# EAGLE schematic pcb-pick-plaz-control_v1d (EAGLE 9.6.2)

## Sheet 1 of 5
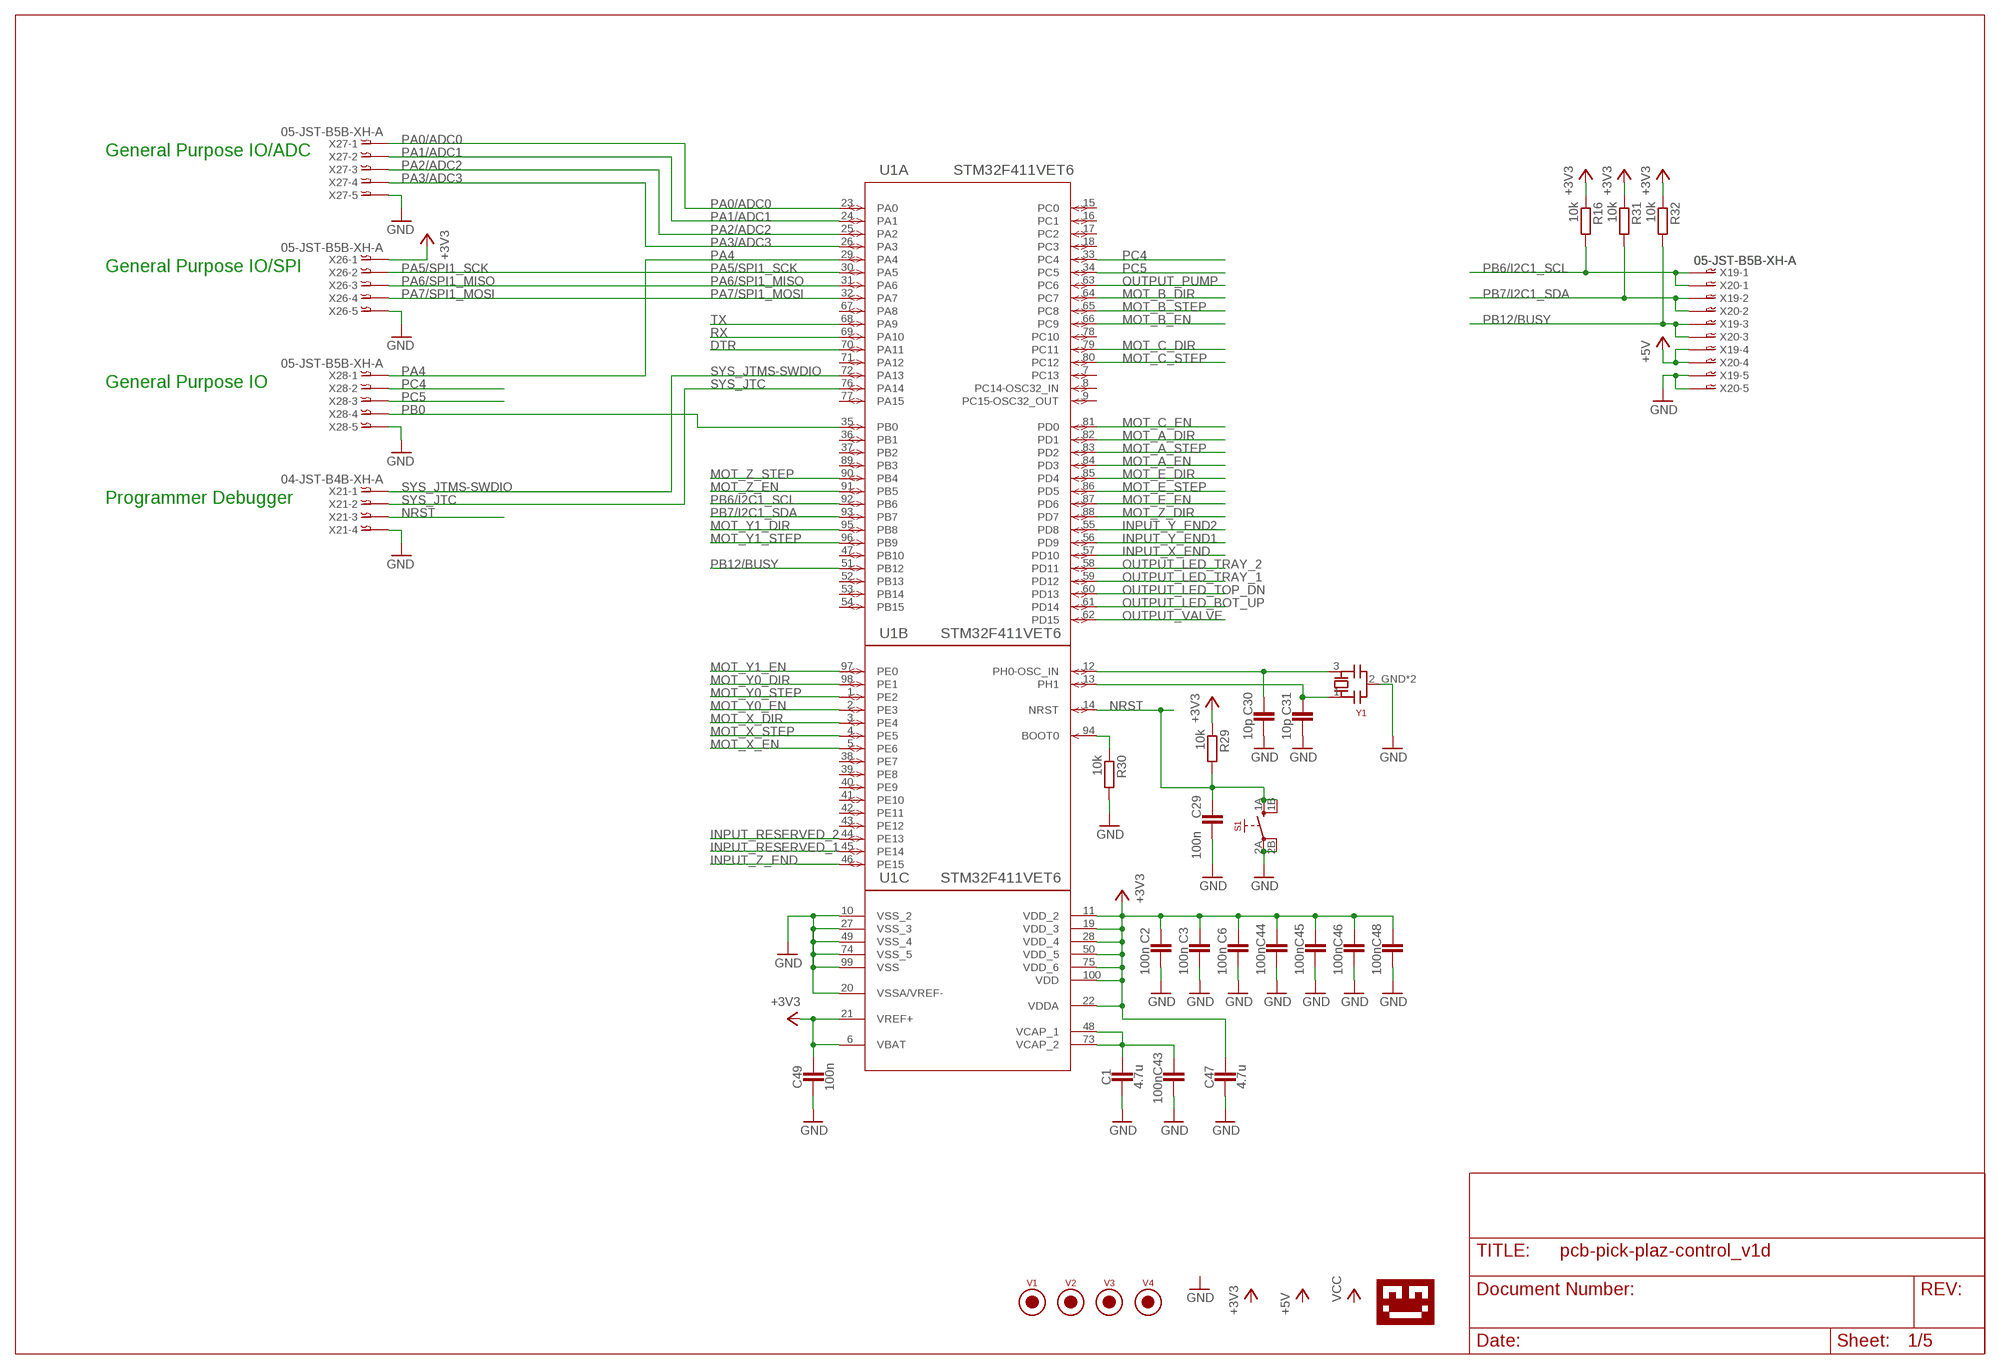
[diagram p0: schematic, sheet 1]

### Parts
C1  4.7u  CAPACITOR0805_CAP  [0805_CAP]
C2  100n  CAPACITOR0603_CAP  [0603_CAP]
C3  100n  CAPACITOR0603_CAP  [0603_CAP]
C6  100n  CAPACITOR0603_CAP  [0603_CAP]
C29  100n  CAPACITOR0603_CAP  [0603_CAP]
C30  10p  CAPACITOR0603_CAP  [0603_CAP]
C31  10p  CAPACITOR0603_CAP  [0603_CAP]
C43  100n  CAPACITOR0603_CAP  [0603_CAP]
C44  100n  CAPACITOR0603_CAP  [0603_CAP]
C45  100n  CAPACITOR0603_CAP  [0603_CAP]
C46  100n  CAPACITOR0603_CAP  [0603_CAP]
C47  4.7u  CAPACITOR0805_CAP  [0805_CAP]
C48  100n  CAPACITOR0603_CAP  [0603_CAP]
C49  100n  CAPACITOR0603_CAP  [0603_CAP]
R16  10k  RESISTOR0603_RES  [0603-RES]
R29  10k  RESISTOR0603_RES  [0603-RES]
R30  10k  RESISTOR0603_RES  [0603-RES]
R31  10k  RESISTOR0603_RES  [0603-RES]
R32  10k  RESISTOR0603_RES  [0603-RES]
S1  SWITCH_2PD  [SWITCH_WH]
U1  STM32F411VET6  [LQFP100-14X14MM]
U$1  LOGO-TOBENG-1MM-FINISH  [TOBENG-1MM-FINISH]
V1  FIDUCIAL2MM  [FIDUCIAL_2MM]
V2  FIDUCIAL2MM  [FIDUCIAL_2MM]
V3  FIDUCIAL2MM  [FIDUCIAL_2MM]
V4  FIDUCIAL2MM  [FIDUCIAL_2MM]
X19  05-JST-B5B-XH-A  [B5B-XH]
X20  05-JST-B5B-XH-A  [B5B-XH]
X21  04-JST-B4B-XH-A  [B4B-XH]
X26  05-JST-B5B-XH-A  [B5B-XH]
X27  05-JST-B5B-XH-A  [B5B-XH]
X28  05-JST-B5B-XH-A  [B5B-XH]
Y1  3213-QUARZ3225  [3225-QUARZ]

### Nets
+3V3: C2.1 C3.1 C6.1 C44.1 C45.1 C46.1 C47.P$1 C48.1 C49.1 R16.1 R29.1 R31.1 R32.1 U1.6(C:VBAT) U1.11(C:VDD_2) U1.19(C:VDD_3) U1.21(C:VREF+) U1.22(C:VDDA) U1.28(C:VDD_4) U1.50(C:VDD_5) U1.75(C:VDD_6) U1.100(C:VDD) X26.P$1 ; also sheet 3,4,5
+5V: X19.P$4 X20.P$4 ; also sheet 2,4,5
DTR: U1.70(A:PA11) ; also sheet 2
GND: C1.P$2 C2.2 C3.2 C6.2 C29.2 C30.2 C31.2 C43.2 C44.2 C45.2 C46.2 C47.P$2 C48.2 C49.2 R30.2 S1.2A S1.2B U1.10(C:VSS_2) U1.20(C:VSSA/VREF-) U1.27(C:VSS_3) U1.49(C:VSS_4) U1.74(C:VSS_5) U1.99(C:VSS) X19.P$5 X20.P$5 X21.P$4 X26.P$5 X27.P$5 X28.P$5 Y1.2_GND Y1.4_GND ; also sheet 2,3,4,5
INPUT_RESERVED_1: U1.45(B:PE14) ; also sheet 4
INPUT_RESERVED_2: U1.44(B:PE13) ; also sheet 4
INPUT_X_END: U1.57(A:PD10) ; also sheet 4
INPUT_Y_END1: U1.56(A:PD9) ; also sheet 4
INPUT_Y_END2: U1.55(A:PD8) ; also sheet 4
INPUT_Z_END: U1.46(B:PE15) ; also sheet 4
MOT_A_DIR: U1.82(A:PD1) ; also sheet 3
MOT_A_EN: U1.84(A:PD3) ; also sheet 3
MOT_A_STEP: U1.83(A:PD2) ; also sheet 3
MOT_B_DIR: U1.64(A:PC7) ; also sheet 3
MOT_B_EN: U1.66(A:PC9) ; also sheet 3
MOT_B_STEP: U1.65(A:PC8) ; also sheet 3
MOT_C_DIR: U1.79(A:PC11) ; also sheet 3
MOT_C_EN: U1.81(A:PD0) ; also sheet 3
MOT_C_STEP: U1.80(A:PC12) ; also sheet 3
MOT_E_DIR: U1.85(A:PD4) ; also sheet 3
MOT_E_EN: U1.87(A:PD6) ; also sheet 3
MOT_E_STEP: U1.86(A:PD5) ; also sheet 3
MOT_X_DIR: U1.3(B:PE4) ; also sheet 3
MOT_X_EN: U1.5(B:PE6) ; also sheet 3
MOT_X_STEP: U1.4(B:PE5) ; also sheet 3
MOT_Y0_DIR: U1.98(B:PE1) ; also sheet 3
MOT_Y0_EN: U1.2(B:PE3) ; also sheet 3
MOT_Y0_STEP: U1.1(B:PE2) ; also sheet 3
MOT_Y1_DIR: U1.95(A:PB8) ; also sheet 3
MOT_Y1_EN: U1.97(B:PE0) ; also sheet 3
MOT_Y1_STEP: U1.96(A:PB9) ; also sheet 3
MOT_Z_DIR: U1.88(A:PD7) ; also sheet 3
MOT_Z_EN: U1.91(A:PB5) ; also sheet 3
MOT_Z_STEP: U1.90(A:PB4) ; also sheet 3
N$1: R30.1 U1.94(B:BOOT0)
N$15: C1.P$1 C43.1 U1.48(C:VCAP_1) U1.73(C:VCAP_2)
N$70: C30.1 U1.12(B:PH0-OSC_IN) Y1.3
N$71: C31.1 U1.13(B:PH1) Y1.1
NRST: C29.1 R29.2 S1.1A S1.1B U1.14(B:NRST) X21.P$3
OUTPUT_LED_BOT_UP: U1.61(A:PD14) ; also sheet 4
OUTPUT_LED_TOP_DN: U1.60(A:PD13) ; also sheet 4
OUTPUT_LED_TRAY_1: U1.59(A:PD12) ; also sheet 4
OUTPUT_LED_TRAY_2: U1.58(A:PD11) ; also sheet 4
OUTPUT_PUMP: U1.63(A:PC6) ; also sheet 4
OUTPUT_VALVE: U1.62(A:PD15) ; also sheet 4
PA0/ADC0: U1.23(A:PA0) X27.P$1
PA1/ADC1: U1.24(A:PA1) X27.P$2
PA2/ADC2: U1.25(A:PA2) X27.P$3
PA3/ADC3: U1.26(A:PA3) X27.P$4
PA4: U1.29(A:PA4) X28.P$1
PA5/SPI1_SCK: U1.30(A:PA5) X26.P$2
PA6/SPI1_MISO: U1.31(A:PA6) X26.P$3
PA7/SPI1_MOSI: U1.32(A:PA7) X26.P$4
PB0: U1.35(A:PB0) X28.P$4
PB6/I2C1_SCL: R16.2 U1.92(A:PB6) X19.P$1 X20.P$1
PB7/I2C1_SDA: R31.2 U1.93(A:PB7) X19.P$2 X20.P$2
PB12/BUSY: R32.2 U1.51(A:PB12) X19.P$3 X20.P$3
PC4: U1.33(A:PC4) X28.P$2
PC5: U1.34(A:PC5) X28.P$3
RX: U1.69(A:PA10) ; also sheet 2
SYS_JTC: U1.76(A:PA14) X21.P$2
SYS_JTMS-SWDIO: U1.72(A:PA13) X21.P$1
TX: U1.68(A:PA9) ; also sheet 2
Unconnected: U1.7(A:PC13) U1.8(A:PC14-OSC32_IN) U1.9(A:PC15-OSC32_OUT) U1.15(A:PC0) U1.16(A:PC1) U1.17(A:PC2) U1.18(A:PC3) U1.36(A:PB1) U1.37(A:PB2) U1.38(B:PE7) U1.39(B:PE8) U1.40(B:PE9) U1.41(B:PE10) U1.42(B:PE11) U1.43(B:PE12) U1.47(A:PB10) U1.52(A:PB13) U1.53(A:PB14) U1.54(A:PB15) U1.67(A:PA8) U1.71(A:PA12) U1.77(A:PA15) U1.78(A:PC10) U1.89(A:PB3)

### Notes on the sheet
- General Purpose IO/ADC
- General Purpose IO/SPI
- General Purpose IO
- Programmer Debugger

## Sheet 2 of 5
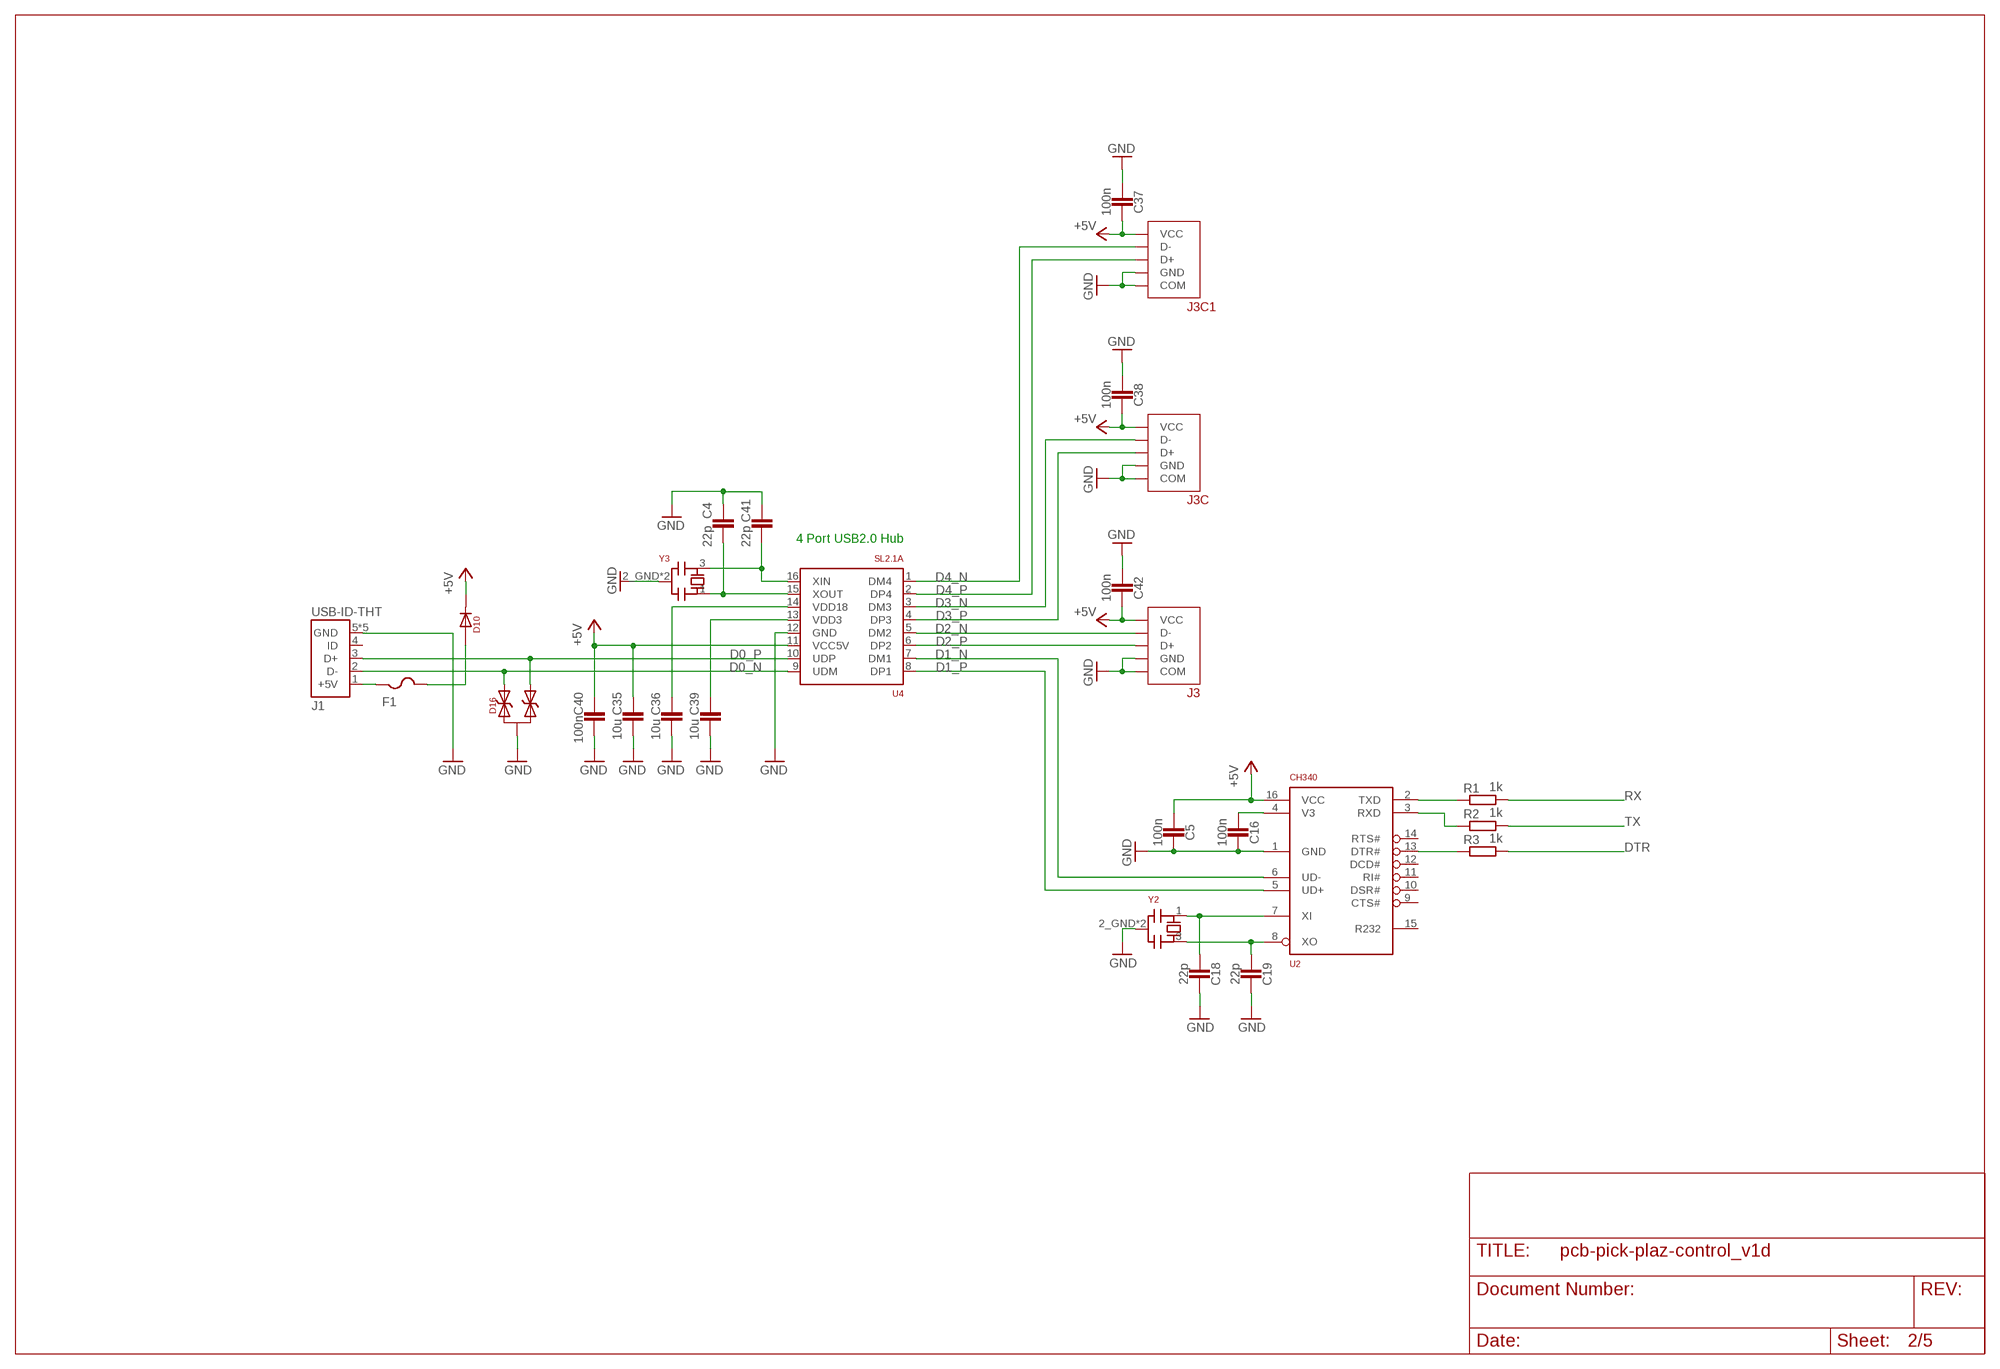
[diagram p1: schematic, sheet 2]

### Parts
C4  22p  CAPACITOR0603_CAP  [0603_CAP]
C5  100n  CAPACITOR0603_CAP  [0603_CAP]
C16  100n  CAPACITOR0603_CAP  [0603_CAP]
C18  22p  CAPACITOR0603_CAP  [0603_CAP]
C19  22p  CAPACITOR0603_CAP  [0603_CAP]
C35  10u  CAPACITOR0805_CAP  [0805_CAP]
C36  10u  CAPACITOR0805_CAP  [0805_CAP]
C37  100n  CAPACITOR0603_CAP  [0603_CAP]
C38  100n  CAPACITOR0603_CAP  [0603_CAP]
C39  10u  CAPACITOR0805_CAP  [0805_CAP]
C40  100n  CAPACITOR0603_CAP  [0603_CAP]
C41  22p  CAPACITOR0603_CAP  [0603_CAP]
C42  100n  CAPACITOR0603_CAP  [0603_CAP]
D10  DIODE-1206  [1206-DOT]
D16  DIODE-TVS  [SOT-23]
F1  PTCFUSE-1206  [R1206]
J1  USB-ID-THT  [USB-MICRO-THT]
J3  USB-LCSC_C42431  [USB-A-LCSC_C42431]
J3C  USB-LCSC_C42431  [USB-A-LCSC_C42431]
J3C1  USB-LCSC_C42431  [USB-A-LCSC_C42431]
R1  1k  RESISTOR0603_RES  [0603-RES]
R2  1k  RESISTOR0603_RES  [0603-RES]
R3  1k  RESISTOR0603_RES  [0603-RES]
U2  CH340  [SOIC-16]
U4  SL2.1A  [SOIC-16]
Y2  3213-QUARZ3225  [3225-QUARZ]
Y3  3213-QUARZ3225  [3225-QUARZ]

### Nets
+5V: C5.2 C35.P$2 C37.1 C38.1 C40.2 C42.1 D10.2 J3.VCC J3C1.VCC J3C.VCC U2.16(VCC) U4.11(VCC5V) ; also sheet 1,4,5
D0_N [usb]: D16.2 J1.2(D-) U4.9(UDM)
D0_P [usb]: D16.1 J1.3(D+) U4.10(UDP)
D1_N [usb]: U2.6(UD-) U4.7(DM1)
D1_P [usb]: U2.5(UD+) U4.8(DP1)
D2_N [usb]: J3.D- U4.5(DM2)
D2_P [usb]: J3.D+ U4.6(DP2)
D3_N [usb]: J3C.D- U4.3(DM3)
D3_P [usb]: J3C.D+ U4.4(DP3)
D4_N [usb]: J3C1.D- U4.1(DM4)
D4_P [usb]: J3C1.D+ U4.2(DP4)
DTR: R3.2 ; also sheet 1
GND: C4.2 C5.1 C16.1 C18.1 C19.1 C35.P$1 C36.P$1 C37.2 C38.2 C39.P$1 C40.1 C41.2 C42.2 D16.3 J1.5(GND) J1.GND1(GND) J1.GND2(GND) J1.GND3(GND) J1.GND4(GND) J3.COM1(COM) J3.COM2(COM) J3.GND J3C1.COM1(COM) J3C1.COM2(COM) J3C1.GND J3C.COM1(COM) J3C.COM2(COM) J3C.GND U2.1(GND) U4.12(GND) Y2.2_GND Y2.4_GND Y3.2_GND Y3.4_GND ; also sheet 1,3,4,5
N$7: C18.2 U2.7(XI) Y2.1
N$8: C19.2 U2.8(XO) Y2.3
N$10: R1.1 U2.2(TXD)
N$11: R2.1 U2.3(RXD)
N$16: C16.2 U2.4(V3)
N$73: C41.1 U4.16(XIN) Y3.3
N$74: R3.1 U2.13(DTR#)
N$76: C4.1 U4.15(XOUT) Y3.1
N$77: C36.P$2 U4.14(VDD18)
N$78: C39.P$2 U4.13(VDD3)
N$81: D10.1 F1.2
RX: R1.2 ; also sheet 1
TX: R2.2 ; also sheet 1
VINUSB: F1.1 J1.1(+5V)
Unconnected: J1.4(ID) U2.9(CTS#) U2.10(DSR#) U2.11(RI#) U2.12(DCD#) U2.14(RTS#) U2.15(R232)

### Notes on the sheet
- 4 Port USB2.0 Hub

## Sheet 3 of 5
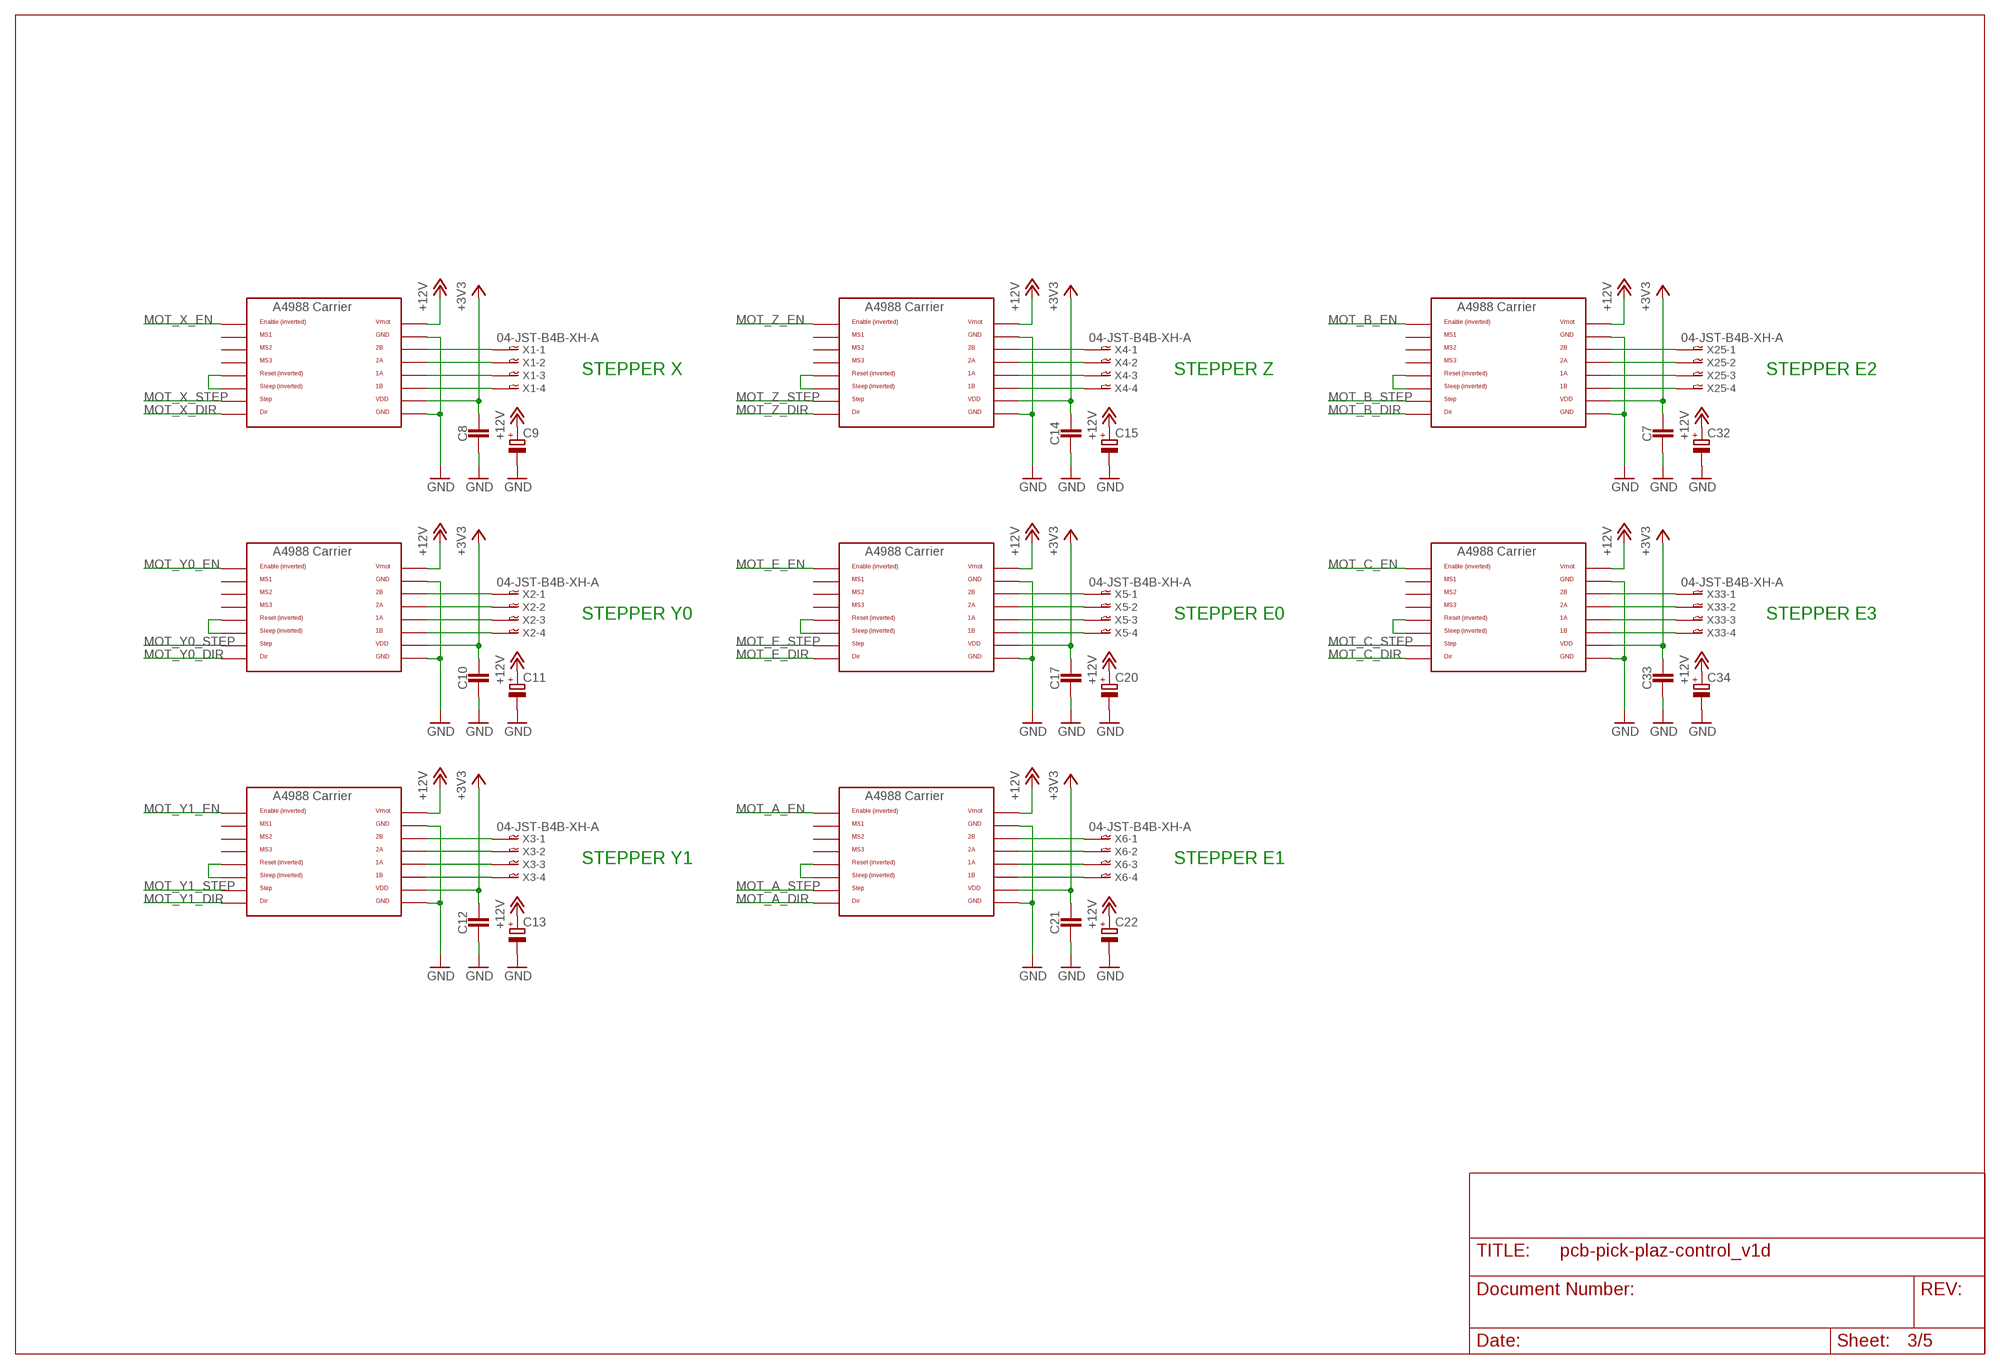
[diagram p2: schematic, sheet 3]

### Parts
C7  CAPACITOR0603_CAP  [0603_CAP]
C8  CAPACITOR0603_CAP  [0603_CAP]
C9  CPOL-EU175TMP-0808  [175TMP-0808]
C10  CAPACITOR0603_CAP  [0603_CAP]
C11  CPOL-EU175TMP-0808  [175TMP-0808]
C12  CAPACITOR0603_CAP  [0603_CAP]
C13  CPOL-EU175TMP-0808  [175TMP-0808]
C14  CAPACITOR0603_CAP  [0603_CAP]
C15  CPOL-EU175TMP-0808  [175TMP-0808]
C17  CAPACITOR0603_CAP  [0603_CAP]
C20  CPOL-EU175TMP-0808  [175TMP-0808]
C21  CAPACITOR0603_CAP  [0603_CAP]
C22  CPOL-EU175TMP-0808  [175TMP-0808]
C32  CPOL-EU175TMP-0808  [175TMP-0808]
C33  CAPACITOR0603_CAP  [0603_CAP]
C34  CPOL-EU175TMP-0808  [175TMP-0808]
U$2  A4988BREAKOUT  [A4988BREAKOUT]
U$3  A4988BREAKOUT  [A4988BREAKOUT]
U$4  A4988BREAKOUT  [A4988BREAKOUT]
U$5  A4988BREAKOUT  [A4988BREAKOUT]
U$6  A4988BREAKOUT  [A4988BREAKOUT]
U$7  A4988BREAKOUT  [A4988BREAKOUT]
U$8  A4988BREAKOUT  [A4988BREAKOUT]
U$9  A4988BREAKOUT  [A4988BREAKOUT]
X1  04-JST-B4B-XH-A  [B4B-XH]
X2  04-JST-B4B-XH-A  [B4B-XH]
X3  04-JST-B4B-XH-A  [B4B-XH]
X4  04-JST-B4B-XH-A  [B4B-XH]
X5  04-JST-B4B-XH-A  [B4B-XH]
X6  04-JST-B4B-XH-A  [B4B-XH]
X25  04-JST-B4B-XH-A  [B4B-XH]
X33  04-JST-B4B-XH-A  [B4B-XH]

### Nets
+3V3: C7.1 C8.1 C10.1 C12.1 C14.1 C17.1 C21.1 C33.1 U$2.VDD U$3.VDD U$4.VDD U$5.VDD U$6.VDD U$7.VDD U$8.VDD U$9.VDD ; also sheet 1,4,5
+12V [power]: C9.+ C11.+ C13.+ C15.+ C20.+ C22.+ C32.+ C34.+ U$2.VMOT U$3.VMOT U$4.VMOT U$5.VMOT U$6.VMOT U$7.VMOT U$8.VMOT U$9.VMOT ; also sheet 4,5
GND: C7.2 C8.2 C9.- C10.2 C11.- C12.2 C13.- C14.2 C15.- C17.2 C20.- C21.2 C22.- C32.- C33.2 C34.- U$2.GND U$2.GND@0(GND) U$3.GND U$3.GND@0(GND) U$4.GND U$4.GND@0(GND) U$5.GND U$5.GND@0(GND) U$6.GND U$6.GND@0(GND) U$7.GND U$7.GND@0(GND) U$8.GND U$8.GND@0(GND) U$9.GND U$9.GND@0(GND) ; also sheet 1,2,4,5
MOT_A_DIR: U$7.DIR ; also sheet 1
MOT_A_EN: U$7.EN ; also sheet 1
MOT_A_STEP: U$7.STEP ; also sheet 1
MOT_B_DIR: U$8.DIR ; also sheet 1
MOT_B_EN: U$8.EN ; also sheet 1
MOT_B_STEP: U$8.STEP ; also sheet 1
MOT_C_DIR: U$9.DIR ; also sheet 1
MOT_C_EN: U$9.EN ; also sheet 1
MOT_C_STEP: U$9.STEP ; also sheet 1
MOT_E_DIR: U$6.DIR ; also sheet 1
MOT_E_EN: U$6.EN ; also sheet 1
MOT_E_STEP: U$6.STEP ; also sheet 1
MOT_X_DIR: U$2.DIR ; also sheet 1
MOT_X_EN: U$2.EN ; also sheet 1
MOT_X_STEP: U$2.STEP ; also sheet 1
MOT_Y0_DIR: U$3.DIR ; also sheet 1
MOT_Y0_EN: U$3.EN ; also sheet 1
MOT_Y0_STEP: U$3.STEP ; also sheet 1
MOT_Y1_DIR: U$4.DIR ; also sheet 1
MOT_Y1_EN: U$4.EN ; also sheet 1
MOT_Y1_STEP: U$4.STEP ; also sheet 1
MOT_Z_DIR: U$5.DIR ; also sheet 1
MOT_Z_EN: U$5.EN ; also sheet 1
MOT_Z_STEP: U$5.STEP ; also sheet 1
N$2 [power]: U$2.2B X1.P$1
N$3 [power]: U$2.2A X1.P$2
N$4 [power]: U$2.1A X1.P$3
N$5 [power]: U$2.1B X1.P$4
N$6 [power]: U$6.2B X5.P$1
N$9: U$2.RST U$2.SLP(SLEEP)
N$13 [power]: U$6.2A X5.P$2
N$14 [power]: U$6.1A X5.P$3
N$17 [power]: U$3.2B X2.P$1
N$18 [power]: U$3.2A X2.P$2
N$19 [power]: U$3.1A X2.P$3
N$20 [power]: U$3.1B X2.P$4
N$21: U$3.RST U$3.SLP(SLEEP)
N$22 [power]: U$4.2B X3.P$1
N$23 [power]: U$4.2A X3.P$2
N$24 [power]: U$4.1A X3.P$3
N$25 [power]: U$4.1B X3.P$4
N$26: U$4.RST U$4.SLP(SLEEP)
N$27 [power]: U$5.2B X4.P$1
N$28 [power]: U$5.2A X4.P$2
N$29 [power]: U$5.1A X4.P$3
N$30 [power]: U$5.1B X4.P$4
N$31: U$5.RST U$5.SLP(SLEEP)
N$32 [power]: U$6.1B X5.P$4
N$33: U$6.RST U$6.SLP(SLEEP)
N$34 [power]: U$7.2B X6.P$1
N$35 [power]: U$7.2A X6.P$2
N$36 [power]: U$7.1A X6.P$3
N$37 [power]: U$7.1B X6.P$4
N$38: U$7.RST U$7.SLP(SLEEP)
N$69 [power]: U$8.2B X25.P$1
N$72 [power]: U$8.2A X25.P$2
N$79 [power]: U$8.1A X25.P$3
N$85 [power]: U$8.1B X25.P$4
N$88: U$8.RST U$8.SLP(SLEEP)
N$93 [power]: U$9.2B X33.P$1
N$95 [power]: U$9.2A X33.P$2
N$96 [power]: U$9.1A X33.P$3
N$97 [power]: U$9.1B X33.P$4
N$98: U$9.RST U$9.SLP(SLEEP)
Unconnected: U$2.MS1 U$2.MS2 U$2.MS3 U$3.MS1 U$3.MS2 U$3.MS3 U$4.MS1 U$4.MS2 U$4.MS3 U$5.MS1 U$5.MS2 U$5.MS3 U$6.MS1 U$6.MS2 U$6.MS3 U$7.MS1 U$7.MS2 U$7.MS3 U$8.MS1 U$8.MS2 U$8.MS3 U$9.MS1 U$9.MS2 U$9.MS3

### Notes on the sheet
- STEPPER X | STEPPER Z | STEPPER E2
- STEPPER Y0 | STEPPER E0 | STEPPER E3
- STEPPER Y1 | STEPPER E1

## Sheet 4 of 5
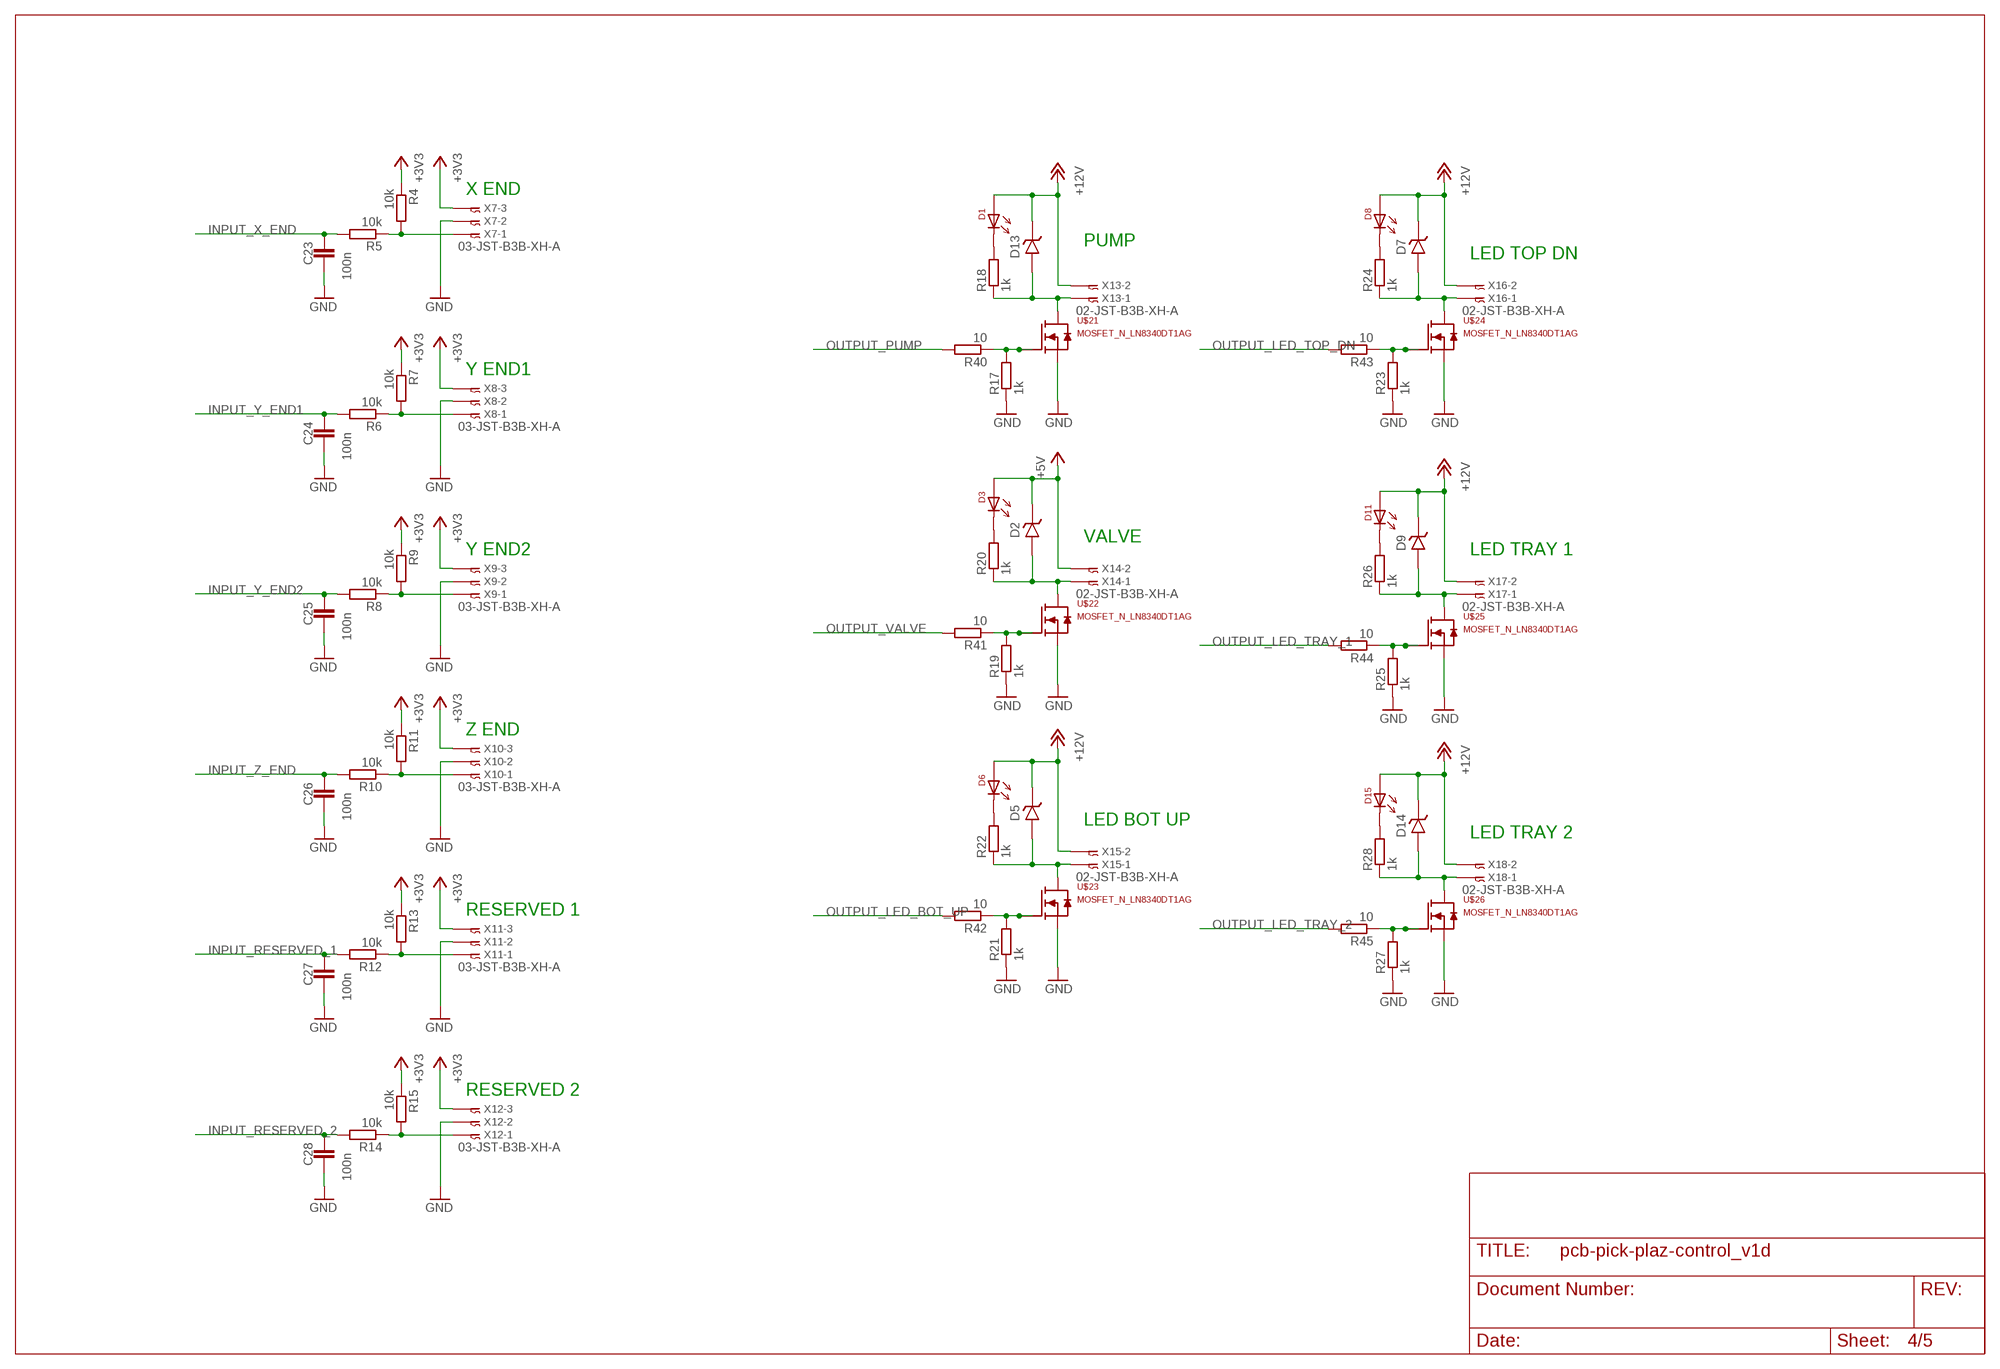
[diagram p3: schematic, sheet 4]

### Parts
C23  100n  CAPACITOR0603_CAP  [0603_CAP]
C24  100n  CAPACITOR0603_CAP  [0603_CAP]
C25  100n  CAPACITOR0603_CAP  [0603_CAP]
C26  100n  CAPACITOR0603_CAP  [0603_CAP]
C27  100n  CAPACITOR0603_CAP  [0603_CAP]
C28  100n  CAPACITOR0603_CAP  [0603_CAP]
D1  LED-0805  [0805-DOT]
D2  DIODE_ZENERSOD123  [SOD123]
D3  LED-0805  [0805-DOT]
D5  DIODE_ZENERSOD123  [SOD123]
D6  LED-0805  [0805-DOT]
D7  DIODE_ZENERSOD123  [SOD123]
D8  LED-0805  [0805-DOT]
D9  DIODE_ZENERSOD123  [SOD123]
D11  LED-0805  [0805-DOT]
D13  DIODE_ZENERSOD123  [SOD123]
D14  DIODE_ZENERSOD123  [SOD123]
D15  LED-0805  [0805-DOT]
R4  10k  RESISTOR0603_RES  [0603-RES]
R5  10k  RESISTOR0603_RES  [0603-RES]
R6  10k  RESISTOR0603_RES  [0603-RES]
R7  10k  RESISTOR0603_RES  [0603-RES]
R8  10k  RESISTOR0603_RES  [0603-RES]
R9  10k  RESISTOR0603_RES  [0603-RES]
R10  10k  RESISTOR0603_RES  [0603-RES]
R11  10k  RESISTOR0603_RES  [0603-RES]
R12  10k  RESISTOR0603_RES  [0603-RES]
R13  10k  RESISTOR0603_RES  [0603-RES]
R14  10k  RESISTOR0603_RES  [0603-RES]
R15  10k  RESISTOR0603_RES  [0603-RES]
R17  1k  RESISTOR0603_RES  [0603-RES]
R18  1k  RESISTOR0603_RES  [0603-RES]
R19  1k  RESISTOR0603_RES  [0603-RES]
R20  1k  RESISTOR0603_RES  [0603-RES]
R21  1k  RESISTOR0603_RES  [0603-RES]
R22  1k  RESISTOR0603_RES  [0603-RES]
R23  1k  RESISTOR0603_RES  [0603-RES]
R24  1k  RESISTOR0603_RES  [0603-RES]
R25  1k  RESISTOR0603_RES  [0603-RES]
R26  1k  RESISTOR0603_RES  [0603-RES]
R27  1k  RESISTOR0603_RES  [0603-RES]
R28  1k  RESISTOR0603_RES  [0603-RES]
R40  10  RESISTOR0603_RES  [0603-RES]
R41  10  RESISTOR0603_RES  [0603-RES]
R42  10  RESISTOR0603_RES  [0603-RES]
R43  10  RESISTOR0603_RES  [0603-RES]
R44  10  RESISTOR0603_RES  [0603-RES]
R45  10  RESISTOR0603_RES  [0603-RES]
U$21  MOSFET_N_LN8340DT1AG  [DFN3030-8B]
U$22  MOSFET_N_LN8340DT1AG  [DFN3030-8B]
U$23  MOSFET_N_LN8340DT1AG  [DFN3030-8B]
U$24  MOSFET_N_LN8340DT1AG  [DFN3030-8B]
U$25  MOSFET_N_LN8340DT1AG  [DFN3030-8B]
U$26  MOSFET_N_LN8340DT1AG  [DFN3030-8B]
X7  03-JST-B3B-XH-A  [B3B-XH]
X8  03-JST-B3B-XH-A  [B3B-XH]
X9  03-JST-B3B-XH-A  [B3B-XH]
X10  03-JST-B3B-XH-A  [B3B-XH]
X11  03-JST-B3B-XH-A  [B3B-XH]
X12  03-JST-B3B-XH-A  [B3B-XH]
X13  02-JST-B3B-XH-A  [B2B-XH]
X14  02-JST-B3B-XH-A  [B2B-XH]
X15  02-JST-B3B-XH-A  [B2B-XH]
X16  02-JST-B3B-XH-A  [B2B-XH]
X17  02-JST-B3B-XH-A  [B2B-XH]
X18  02-JST-B3B-XH-A  [B2B-XH]

### Nets
+3V3: R4.1 R7.1 R9.1 R11.1 R13.1 R15.1 X7.P$3 X8.P$3 X9.P$3 X10.P$3 X11.P$3 X12.P$3 ; also sheet 1,3,5
+5V: D2.K(CATHODE) D3.1 X14.P$2 ; also sheet 1,2,5
+12V [power]: D1.1 D5.K(CATHODE) D6.1 D7.K(CATHODE) D8.1 D9.K(CATHODE) D11.1 D13.K(CATHODE) D14.K(CATHODE) D15.1 X13.P$2 X15.P$2 X16.P$2 X17.P$2 X18.P$2 ; also sheet 3,5
GND: C23.2 C24.2 C25.2 C26.2 C27.2 C28.2 R17.1 R19.1 R21.1 R23.1 R25.1 R27.1 U$21.S1(S) U$21.S2(S) U$21.S3(S) U$22.S1(S) U$22.S2(S) U$22.S3(S) U$23.S1(S) U$23.S2(S) U$23.S3(S) U$24.S1(S) U$24.S2(S) U$24.S3(S) U$25.S1(S) U$25.S2(S) U$25.S3(S) U$26.S1(S) U$26.S2(S) U$26.S3(S) X7.P$2 X8.P$2 X9.P$2 X10.P$2 X11.P$2 X12.P$2 ; also sheet 1,2,3,5
INPUT_RESERVED_1: C27.1 R12.2 ; also sheet 1
INPUT_RESERVED_2: C28.1 R14.2 ; also sheet 1
INPUT_X_END: C23.1 R5.2 ; also sheet 1
INPUT_Y_END1: C24.1 R6.2 ; also sheet 1
INPUT_Y_END2: C25.1 R8.2 ; also sheet 1
INPUT_Z_END: C26.1 R10.2 ; also sheet 1
N$45: R4.2 R5.1 X7.P$1
N$46: R6.1 R7.2 X8.P$1
N$47: R8.1 R9.2 X9.P$1
N$48: R10.1 R11.2 X10.P$1
N$49: R12.1 R13.2 X11.P$1
N$50: R14.1 R15.2 X12.P$1
N$51: D13.A(ANODE) R18.1 U$21.D X13.P$1
N$52: R17.2 R40.1 U$21.G
N$53: D1.2 R18.2
N$54: D2.A(ANODE) R20.1 U$22.D X14.P$1
N$55: R19.2 R41.1 U$22.G
N$56: D3.2 R20.2
N$57: D5.A(ANODE) R22.1 U$23.D X15.P$1
N$58: R21.2 R42.1 U$23.G
N$59: D6.2 R22.2
N$60: D7.A(ANODE) R24.1 U$24.D X16.P$1
N$61: R23.2 R43.1 U$24.G
N$62: D8.2 R24.2
N$63: D9.A(ANODE) R26.1 U$25.D X17.P$1
N$64: R25.2 R44.1 U$25.G
N$65: D11.2 R26.2
N$66: D14.A(ANODE) R28.1 U$26.D X18.P$1
N$67: R27.2 R45.1 U$26.G
N$68: D15.2 R28.2
OUTPUT_LED_BOT_UP: R42.2 ; also sheet 1
OUTPUT_LED_TOP_DN: R43.2 ; also sheet 1
OUTPUT_LED_TRAY_1: R44.2 ; also sheet 1
OUTPUT_LED_TRAY_2: R45.2 ; also sheet 1
OUTPUT_PUMP: R40.2 ; also sheet 1
OUTPUT_VALVE: R41.2 ; also sheet 1

### Notes on the sheet
- X END
- PUMP
- LED TOP DN
- Y END1
- VALVE
- Y END2 | LED TRAY 1
- Z END
- LED BOT UP
- LED TRAY 2
- RESERVED 1
- RESERVED 2

## Sheet 5 of 5
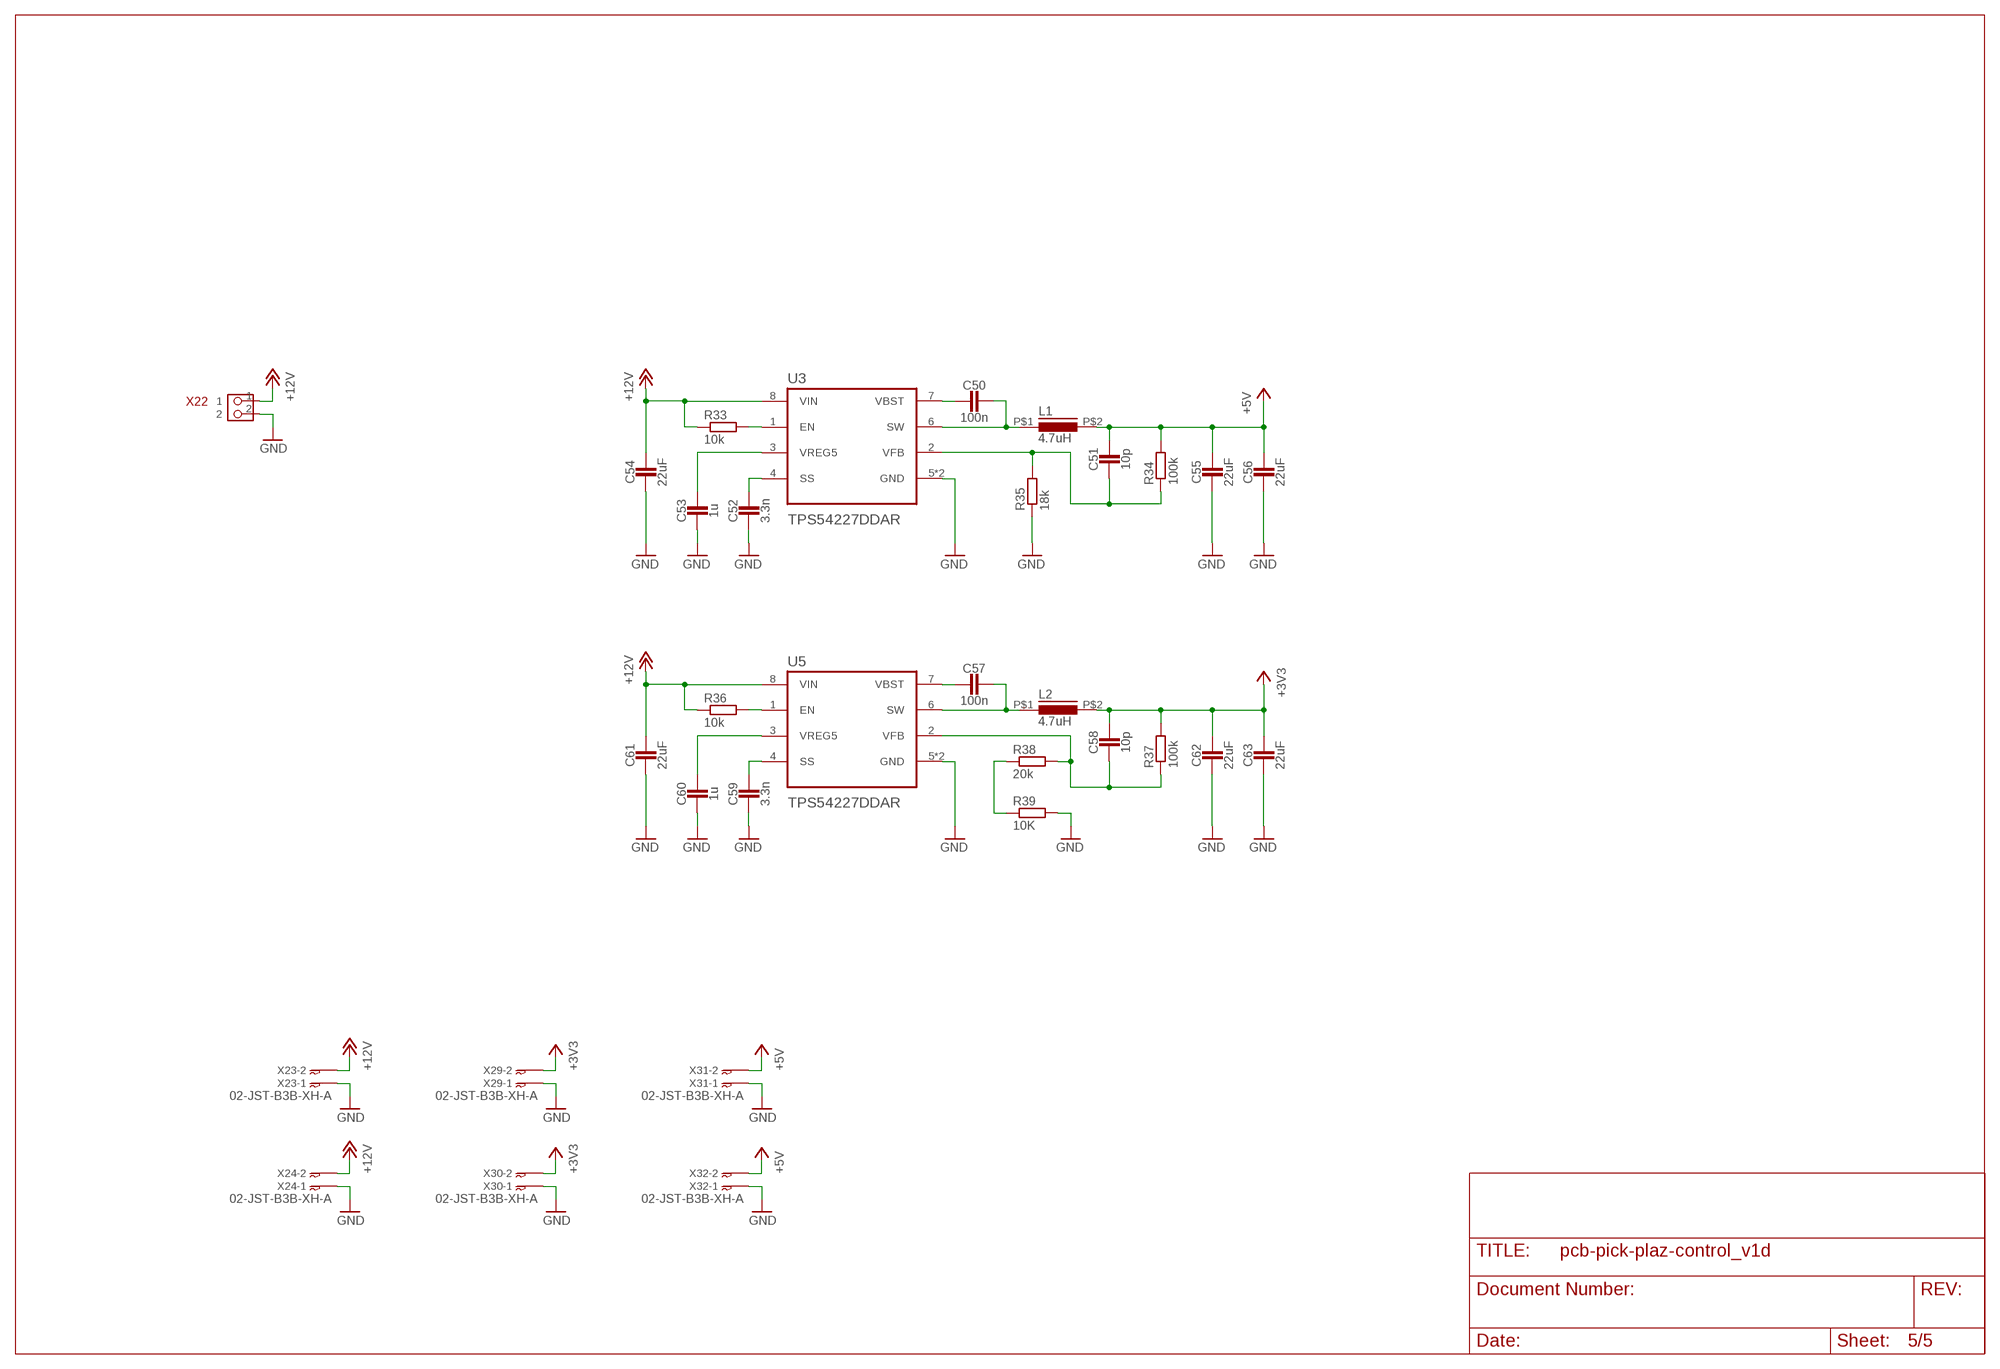
[diagram p4: schematic, sheet 5]

### Parts
C50  100n  CAPACITOR0603_CAP  [0603_CAP]
C51  10p  CAPACITOR0603_CAP  [0603_CAP]
C52  3.3n  CAPACITOR0603_CAP  [0603_CAP]
C53  1u  CAPACITOR0603_CAP  [0603_CAP]
C54  22uF  CAPACITOR1206_CAP  [1206_CAP]
C55  22uF  CAPACITOR0805_CAP  [0805_CAP]
C56  22uF  CAPACITOR0805_CAP  [0805_CAP]
C57  100n  CAPACITOR0603_CAP  [0603_CAP]
C58  10p  CAPACITOR0603_CAP  [0603_CAP]
C59  3.3n  CAPACITOR0603_CAP  [0603_CAP]
C60  1u  CAPACITOR0603_CAP  [0603_CAP]
C61  22uF  CAPACITOR1206_CAP  [1206_CAP]
C62  22uF  CAPACITOR0805_CAP  [0805_CAP]
C63  22uF  CAPACITOR0805_CAP  [0805_CAP]
L1  4.7uH  INDUCTOR  [IND_CR4]
L2  4.7uH  INDUCTOR  [IND_CR4]
R33  10k  RESISTOR0603_RES  [0603-RES]
R34  100k  RESISTOR0603_RES  [0603-RES]
R35  18k  RESISTOR0603_RES  [0603-RES]
R36  10k  RESISTOR0603_RES  [0603-RES]
R37  100k  RESISTOR0603_RES  [0603-RES]
R38  20k  RESISTOR0603_RES  [0603-RES]
R39  10K  RESISTOR0603_RES  [0603-RES]
U3  TPS54227DDAR  [TPS54227DDAR_VREG_LM5017MR/NOPB]
U5  TPS54227DDAR  [TPS54227DDAR_VREG_LM5017MR/NOPB]
X22  PIN_2X13.81MM_LONGPAD  [PIN_2X1_3.81MM_LONGPAD]
X23  02-JST-B3B-XH-A  [B2B-XH]
X24  02-JST-B3B-XH-A  [B2B-XH]
X29  02-JST-B3B-XH-A  [B2B-XH]
X30  02-JST-B3B-XH-A  [B2B-XH]
X31  02-JST-B3B-XH-A  [B2B-XH]
X32  02-JST-B3B-XH-A  [B2B-XH]

### Nets
+3V3: C58.1 C62.P$1 C63.P$1 L2.P$2 R37.2 X29.P$2 X30.P$2 ; also sheet 1,3,4
+5V: C51.1 C55.P$1 C56.P$1 L1.P$2 R34.2 X31.P$2 X32.P$2 ; also sheet 1,2,4
+12V [power]: C54.1 C61.1 R33.1 R36.1 U3.8(VIN) U5.8(VIN) X22.1 X23.P$2 X24.P$2 ; also sheet 3,4
GND: C52.2 C53.2 C54.2 C55.P$2 C56.P$2 C59.2 C60.2 C61.2 C62.P$2 C63.P$2 R35.1 R39.2 U3.5(GND) U3.9(GND) U5.5(GND) U5.9(GND) X22.2 X23.P$1 X24.P$1 X29.P$1 X30.P$1 X31.P$1 X32.P$1 ; also sheet 1,2,3,4
N$12: C50.2 U3.7(VBST)
N$75: C50.1 L1.P$1 U3.6(SW)
N$80: C51.2 R34.1 R35.2 U3.2(VFB)
N$82: C52.1 U3.4(SS)
N$83: C53.1 U3.3(VREG5)
N$84: R33.2 U3.1(EN)
N$86: C57.2 U5.7(VBST)
N$87: C57.1 L2.P$1 U5.6(SW)
N$89: C58.2 R37.1 R38.2 U5.2(VFB)
N$90: C59.1 U5.4(SS)
N$91: C60.1 U5.3(VREG5)
N$92: R36.2 U5.1(EN)
N$94: R38.1 R39.1

## Library data of the parts
C1-C8 C10 C12 C14 C16-C19 C21 C23-C31 C33 C35-C63 = passives:CAPACITOR: SMD Capacitor
C9 C11 C13 C15 C20 C22 C32 C34 = resistor:CPOL-EU: POLARIZED CAPACITOR, European symbol
D1 D3 D6 D8 D11 D15 = ftobler:LED
D2 D5 D7 D9 D13 D14 = passives:DIODE_ZENER
D10 = ftobler:DIODE
D16 = ftobler:DIODE-TVS
F1 = adafruit:PTCFUSE: PTC fuses, resettable thermistors
J1 = ftobler:USB-ID
J3 J3C J3C1 = ftobler:USB
L1 L2 = ftobler:INDUCTOR
R1-R45 = passives:RESISTOR: Resistor Basic schematic elements and footprints for 0201, 0402, 0603, 1206, and PTH resistors.
S1 = ftobler:SWITCH_2PD
U1 = stm32:STM32F411VET6; BUILT_BY: EMA_UL_Team; COPYRIGHT: Copyright (C) 2018 Accelerated Designs. All rights reserved; MANUFACTURER_PART_NUMBER: STM32F411VET6; SOURCELIBRARY: Updates_to_database_2020-10-19; VENDOR: STMicroelectronics
U2 = ftobler:CH340
U3 U5 = pcb-pick-plaz-control_v1b:TPS54227DDAR: Check prices <https://pricing.snapeda.com/parts/TPS54227DDAR/Texas%20Instruments/view-part?ref=eda>; AVAILABILITY: Good; DESCRIPTION: 4.5 V to 18 V input, 2 A synchronous step-down converter in HSOP and VSON package 8-SO PowerPAD -40 to 85; MF: Texas Instruments; MP: TPS54227DDAR; PACKAGE: HSOIC-8 Texas Instruments; PRICE: None; PURCHASE-URL: https://pricing.snapeda.com/search/part/TPS54227DDAR/?ref=eda
U4 = ftobler:SL2.1A
U$1 = ftobler:LOGO
U$2-U$9 = RepRapjr:A4988BREAKOUT
U$21-U$26 = ftobler:MOSFET_N
V1-V4 = ftobler:FIDUCIAL
X1-X6 X21 X25 X33 = bt_con-jst-xh:04-JST: JST CONNECTOR
X7-X12 = bt_con-jst-xh:03-JST: JST CONNECTOR
X13-X18 X23 X24 X29-X32 = bt_con-jst-xh:02-JST: JST CONNECTOR
X19 X20 X26-X28 = bt_con-jst-xh:05-JST: JST CONNECTOR
X22 = ftobler-conn:PIN_2X1
Y1-Y3 = ftobler:3213-QUARZ

## Net classes
1 usb: width 0.25 mm, clearance 0.4 mm to class 0, clearance 0.15 mm
2 power: width 0.3 mm, clearance 0.3 mm to class 0, clearance 0.3 mm to class 1, clearance 0.3 mm
3 gnd: clearance 0.5 mm to class 1, clearance 0.5 mm to class 2